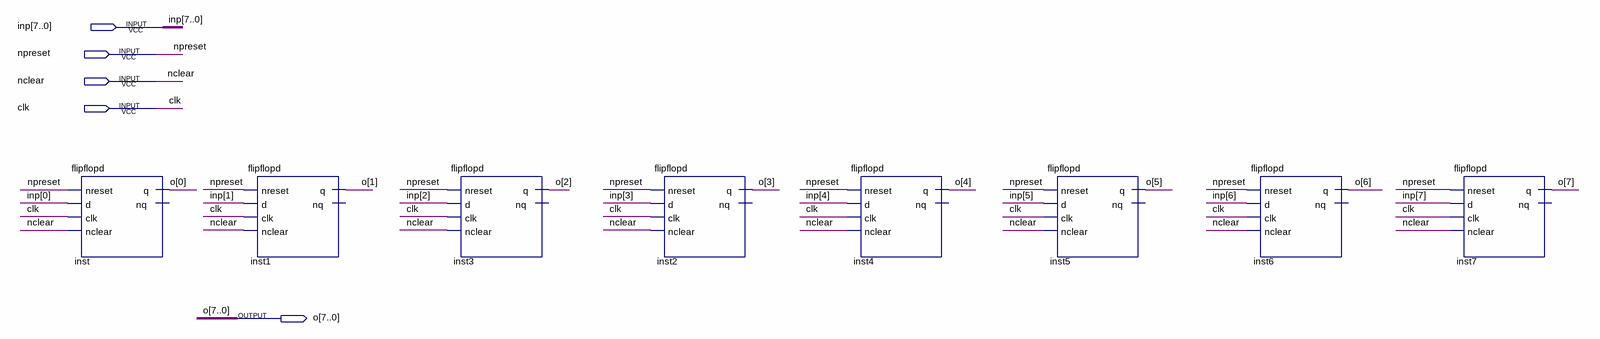
[diagram p0: schematic sheet]
// Quartus schematic 8bitregister.bdf as structural Verilog: 8 symbols, 5 pins
module \8bitregister  (
  input  [7:0] inp,
  input  npreset,
  input  nclear,
  input  clk,
  output [7:0] o
);

  flipflopd inst (.nreset(npreset), .d(inp[0]), .clk(clk), .nclear(nclear), .q(o[0]));  // open: nq
  flipflopd inst1 (.nreset(npreset), .d(inp[1]), .clk(clk), .nclear(nclear), .q(o[1]));  // open: nq
  flipflopd inst3 (.nreset(npreset), .d(inp[2]), .clk(clk), .nclear(nclear), .q(o[2]));  // open: nq
  flipflopd inst2 (.nreset(npreset), .d(inp[3]), .clk(clk), .nclear(nclear), .q(o[3]));  // open: nq
  flipflopd inst4 (.nreset(npreset), .d(inp[4]), .clk(clk), .nclear(nclear), .q(o[4]));  // open: nq
  flipflopd inst5 (.nreset(npreset), .d(inp[5]), .clk(clk), .nclear(nclear), .q(o[5]));  // open: nq
  flipflopd inst6 (.nreset(npreset), .d(inp[6]), .clk(clk), .nclear(nclear), .q(o[6]));  // open: nq
  flipflopd inst7 (.nreset(npreset), .d(inp[7]), .clk(clk), .nclear(nclear), .q(o[7]));  // open: nq
endmodule
